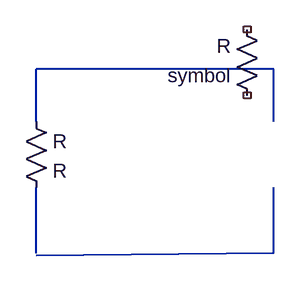
[diagram p0: schematic input.asc]
input.asc, the LTspice schematic file:
Version 4
SHEET 1 2068 1956
WIRE 48 -32 -240 -32
WIRE -240 32 -240 -32
WIRE 48 32 48 -32
WIRE -240 192 -240 112
WIRE 48 192 48 112
WIRE 48 192 -240 195
SYMBOL res -256 16 R91
SYMATTR InstName R
SYMBOL res 32 16 R180
SYMATTR InstName symbol

The netlist it stands for:
* input.asc
R N001 N002 R
R§symbol NC_01 NC_02 R
.backanno
.end